# Altium schematic sheet SAMD51_DevBoard.SchDoc: SAMD51 Development Board
size A3; CompanyName: ALP Electronics; DrawnBy: Caner ALP; Engineer: Caner ALP; Organization: ALP Electronics; Address1: Vasteras; Address2: SWEDEN; DocumentNumber: 1; Revision: 0.1; SheetNumber: 1; SheetTotal: 1
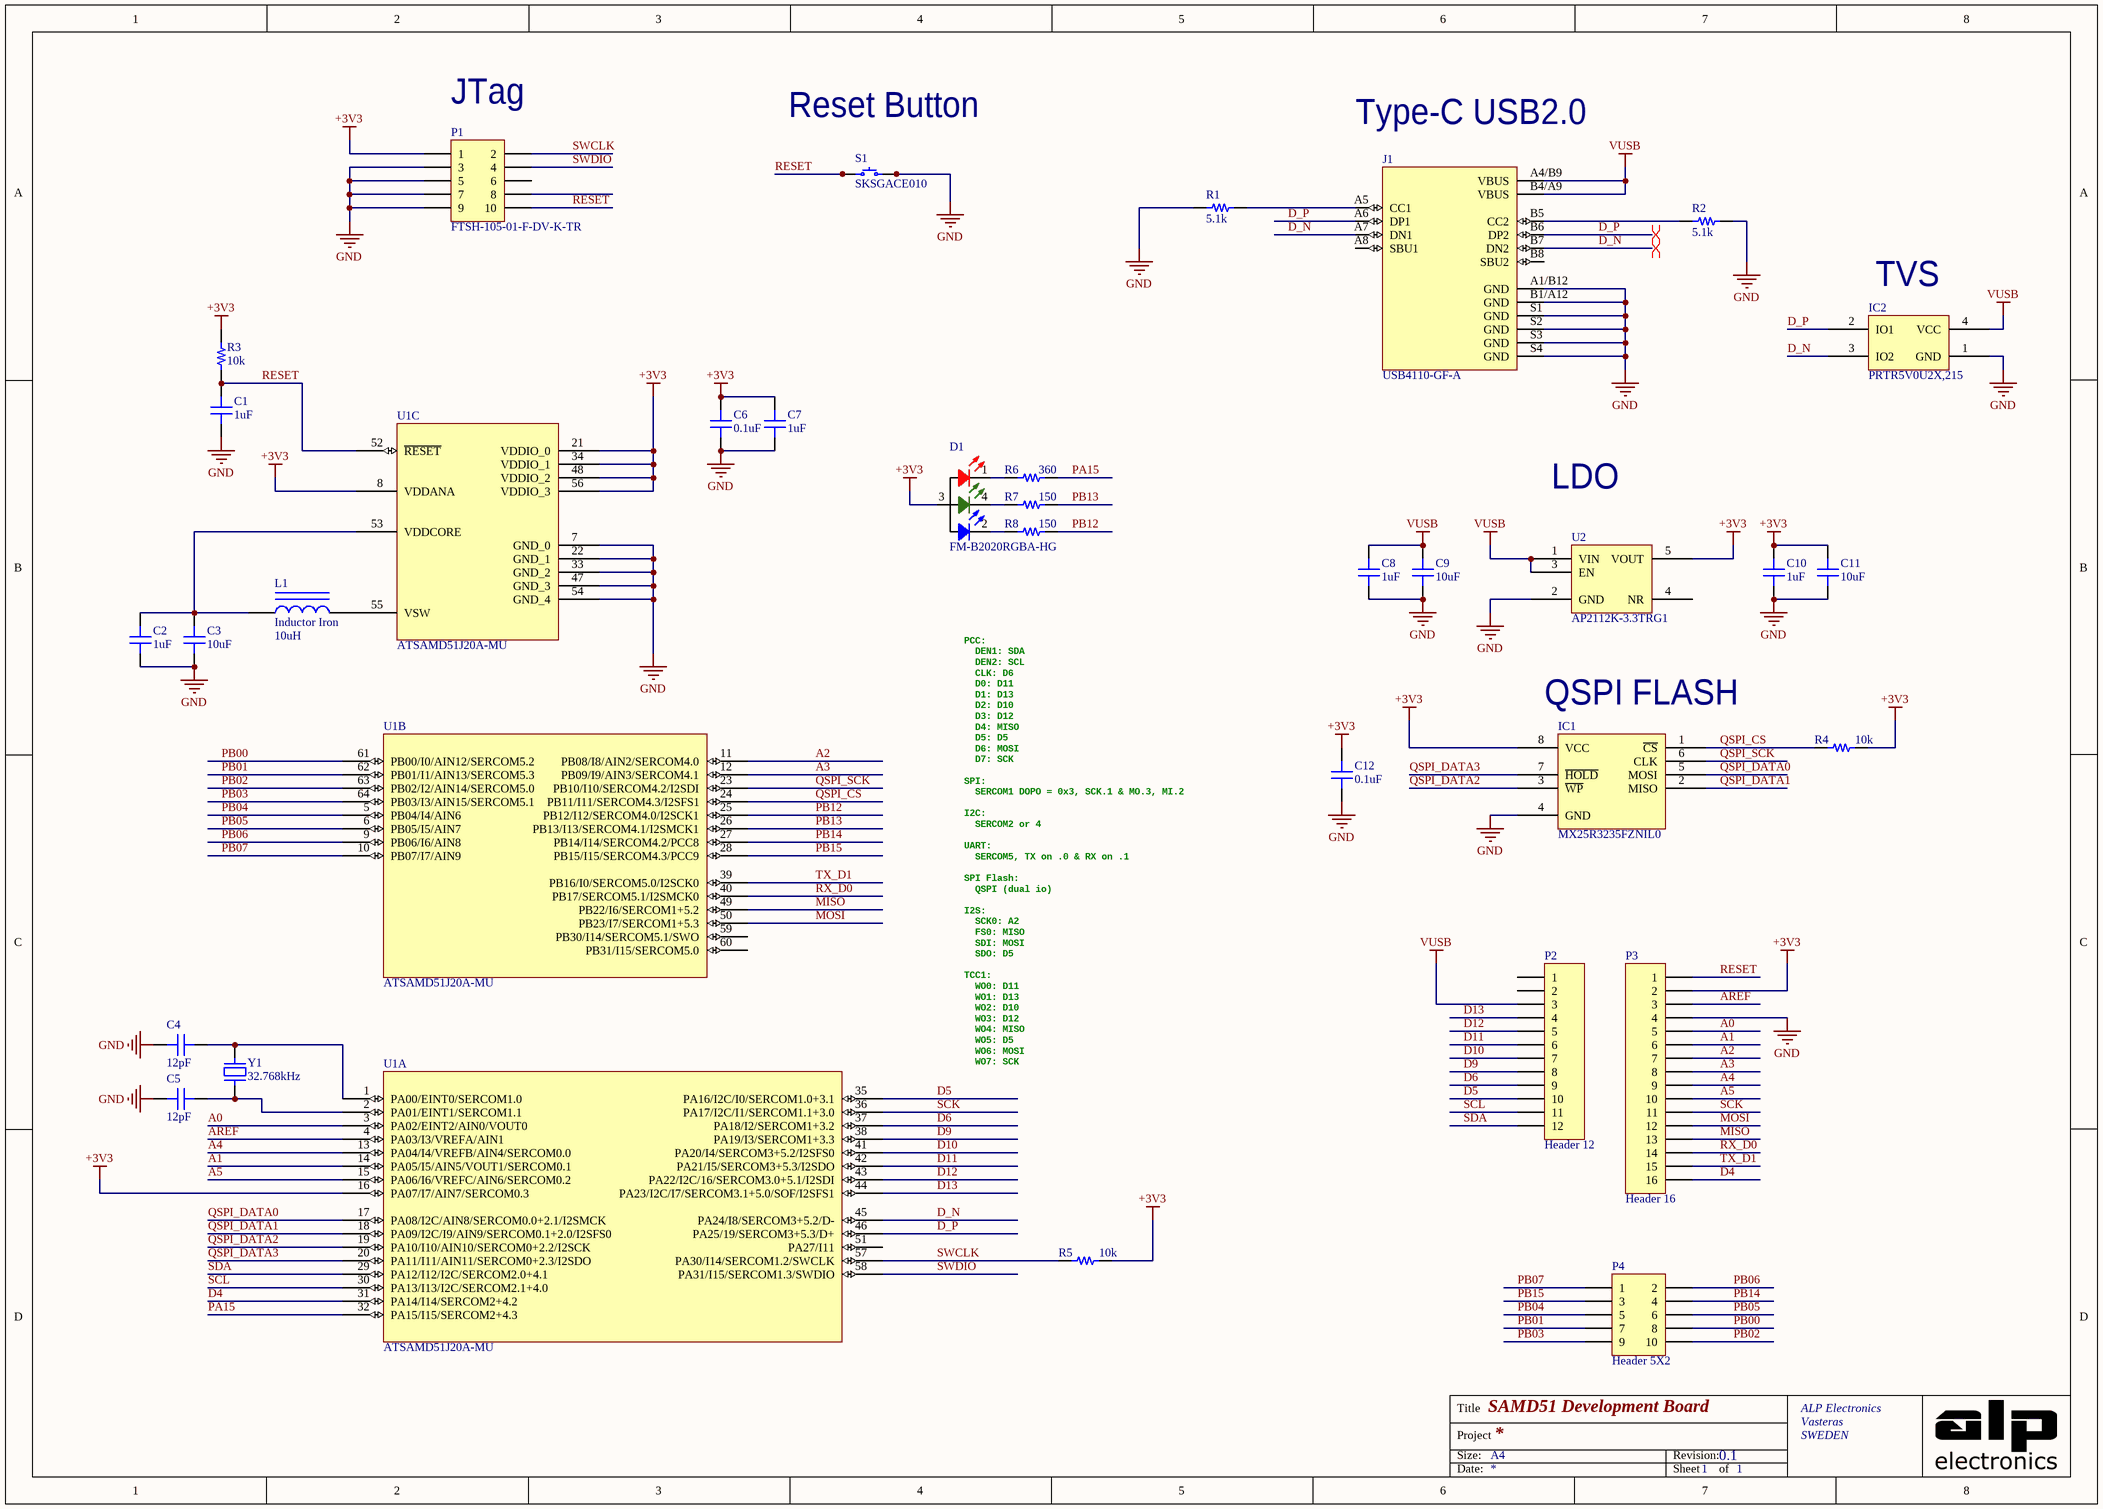
[diagram p0: SAMD51_DevBoard.SchDoc]

## Parts
C1  1uF  [CAP 0603/1608]
C2  1uF  [CAP 0603/1608]
C3  10uF  [CAP 0603/1608]
C4  12pF  [CAP 0603/1608]
C5  12pF  [CAP 0603/1608]
C6  0.1uF  [CAP 0603/1608]
C7  1uF  [CAP 0603/1608]
C8  1uF  [CAP 0603/1608]
C9  10uF  [CAP 0603/1608]
C10  1uF  [CAP 0603/1608]
C11  10uF  [CAP 0603/1608]
C12  0.1uF  [CAP 0603/1608]
D1  FM-B2020RGBA-HG  [FM-B2020RGBA-HG]
IC1  MX25R3235FZNIL0  [SPANSION WSON-8 6x5MM]
IC2  PRTR5V0U2X,215  [SOT143B]
J1  USB4110-GF-A  [USB4110-GF-A]
L1  Inductor Iron  value 10uH  [IND_Würth_74404020100]
P1  FTSH-105-01-F-DV-K-TR  [FTSH-105-01-F-DV-K-TR]
P2  Header 12  [HDR1X12]
P3  Header 16  [HDR1X16]
P4  Header 5X2  [HDR2X5]
R1  5.1k  [RES 0603/1608]
R2  5.1k  [RES 0603/1608]
R3  10k  [RES 0603/1608]
R4  10k  [RES 0603/1608]
R5  10k  [RES 0603/1608]
R6  360  [RES 0603/1608]
R7  150  [RES 0603/1608]
R8  150  [RES 0603/1608]
S1  SKSGACE010  [SKSGACE010]
U1  ATSAMD51J20A-MU  [SI LABS QFN-64_S]  (parts A,B,C of 3)
U2  AP2112K-3.3TRG1  [TI SOT-23-5 DBV]
Y1  32.768kHz  [ABRACON ABS07]

## Nets
+3V3: C6.2 C7.2 C10.2 C11.2 C12.2 D1.3 IC1.8(VCC) P1.1 P3.2 R3.2 R4.2 R5.2 U1.8(VDDANA) U1.16(PA07/I7/AIN7/SERCOM0.3) U1.21(VDDIO_0) U1.34(VDDIO_1) U1.48(VDDIO_2) U1.56(VDDIO_3) U2.5(VOUT)
GND: C1.1 C2.1 C3.1 C4.1 C5.1 C6.1 C7.1 C8.1 C9.1 C10.1 C11.1 C12.1 IC1.4(GND) IC2.1(GND) J1.A1/B12(GND) J1.B1/A12(GND) J1.S1(GND) J1.S2(GND) J1.S3(GND) J1.S4(GND) P1.3 P1.5 P1.7 P1.9 P3.4 R1.1 R2.2 S1.3 S1.4 U1.7(GND_0) U1.22(GND_1) U1.33(GND_2) U1.47(GND_3) U1.54(GND_4) U2.2(GND)
VUSB: C8.2 C9.2 IC2.4(VCC) J1.A4/B9(VBUS) J1.B4/A9(VBUS) P2.3 U2.1(VIN) U2.3(EN)
A0: P3.5 U1.3(PA02/EINT2/AIN0/VOUT0)
A1: P3.6 U1.14(PA05/I5/AIN5/VOUT1/SERCOM0.1)
A2: P3.7 U1.11(PB08/I8/AIN2/SERCOM4.0)
A3: P3.8 U1.12(PB09/I9/AIN3/SERCOM4.1)
A4: P3.9 U1.13(PA04/I4/VREFB/AIN4/SERCOM0.0)
A5: P3.10 U1.15(PA06/I6/VREFC/AIN6/SERCOM0.2)
AREF: P3.3 U1.4(PA03/I3/VREFA/AIN1)
D4: P3.16 U1.31(PA14/I14/SERCOM2+4.2)
D5: P2.10 U1.35(PA16/I2C/I0/SERCOM1.0+3.1)
D6: P2.9 U1.37(PA18/I2/SERCOM1+3.2)
D9: P2.8 U1.38(PA19/I3/SERCOM1+3.3)
D10: P2.7 U1.41(PA20/I4/SERCOM3+5.2/I2SFS0)
D11: P2.6 U1.42(PA21/I5/SERCOM3+5.3/I2SDO)
D12: P2.5 U1.43(PA22/I2C/16/SERCOM3.0+5.1/I2SDI)
D13: P2.4 U1.44(PA23/I2C/I7/SERCOM3.1+5.0/SOF/I2SFS1)
D_N: IC2.3(IO2) J1.A7(DN1) J1.B7(DN2) U1.45(PA24/I8/SERCOM3+5.2/D-)
D_P: IC2.2(IO1) J1.A6(DP1) J1.B6(DP2) U1.46(PA25/19/SERCOM3+5.3/D+)
MISO: P3.13 U1.49(PB22/I6/SERCOM1+5.2)
MOSI: P3.12 U1.50(PB23/I7/SERCOM1+5.3)
PA15: R6.2 U1.32(PA15/I15/SERCOM2+4.3)
PB00: P4.8 U1.61(PB00/I0/AIN12/SERCOM5.2)
PB01: P4.7 U1.62(PB01/I1/AIN13/SERCOM5.3)
PB02: P4.10 U1.63(PB02/I2/AIN14/SERCOM5.0)
PB03: P4.9 U1.64(PB03/I3/AIN15/SERCOM5.1)
PB04: P4.5 U1.5(PB04/I4/AIN6)
PB05: P4.6 U1.6(PB05/I5/AIN7)
PB06: P4.2 U1.9(PB06/I6/AIN8)
PB07: P4.1 U1.10(PB07/I7/AIN9)
PB12: R8.2 U1.25(PB12/I12/SERCOM4.0/I2SCK1)
PB13: R7.2 U1.26(PB13/I13/SERCOM4.1/I2SMCK1)
PB14: P4.4 U1.27(PB14/I14/SERCOM4.2/PCC8)
PB15: P4.3 U1.28(PB15/I15/SERCOM4.3/PCC9)
QSPI_CS: IC1.1(~{CS}) R4.1 U1.24(PB11/I11/SERCOM4.3/I2SFS1)
QSPI_DATA0: IC1.5(MOSI) U1.17(PA08/I2C/AIN8/SERCOM0.0+2.1/I2SMCK)
QSPI_DATA1: IC1.2(MISO) U1.18(PA09/I2C/I9/AIN9/SERCOM0.1+2.0/I2SFS0)
QSPI_DATA2: IC1.3(~{WP}) U1.19(PA10/I10/AIN10/SERCOM0+2.2/I2SCK)
QSPI_DATA3: IC1.7(~{HOLD}) U1.20(PA11/I11/AIN11/SERCOM0+2.3/I2SDO)
QSPI_SCK: IC1.6(CLK) U1.23(PB10/I10/SERCOM4.2/I2SDI)
RESET: C1.2 P1.10 P3.1 R3.1 S1.1 S1.2 U1.52(~{RESET})
RX_D0: P3.14 U1.40(PB17/SERCOM5.1/I2SMCK0)
SCK: P3.11 U1.36(PA17/I2C/I1/SERCOM1.1+3.0)
SCL: P2.11 U1.30(PA13/I13/I2C/SERCOM2.1+4.0)
SDA: P2.12 U1.29(PA12/I12/I2C/SERCOM2.0+4.1)
SWCLK: P1.2 R5.1 U1.57(PA30/I14/SERCOM1.2/SWCLK)
SWDIO: P1.4 U1.58(PA31/I15/SERCOM1.3/SWDIO)
TX_D1: P3.15 U1.39(PB16/I0/SERCOM5.0/I2SCK0)
NetC2_2: C2.2 C3.2 L1.1 U1.53(VDDCORE)
NetC4_2: C4.2 U1.1(PA00/EINT0/SERCOM1.0) Y1.2
NetC5_2: C5.2 U1.2(PA01/EINT1/SERCOM1.1) Y1.1
NetD1_1: D1.1 R6.1
NetD1_2: D1.2 R8.1
NetD1_4: D1.4 R7.1
NetJ1_A5: J1.A5(CC1) R1.2
NetJ1_B5: J1.B5(CC2) R2.1
NetL1_2: L1.2 U1.55(VSW)

Not connected (* = marked no-connect by the designer): J1 A8(SBU1) B8(SBU2); P1 6 8; P2 1 2; U1 51(PA27/I11) 59(PB30/I14/SERCOM5.1/SWO) 60(PB31/I15/SERCOM5.0); U2 4(NR)

## Layout directives
differential pair; differential pair class DIFF: D_P
differential pair: D_N

## Notes on the sheet
- (near P1) JTag
- (near S1) Reset Button
- (near J1) Type-C USB2.0
- (near IC2) TVS
- LDO
- (near IC1) QSPI FLASH
- PCC:
  DEN1: SDA
  DEN2: SCL
  CLK: D6
  D0: D11
  D1: D13
  D2: D10
  D3: D12
  D4: MISO
  D5: D5
  D6: MOSI
  D7: SCK
  SPI:
  SERCOM1 DOPO = 0x3, SCK.1 & MO.3, MI.2
  I2C:
  SERCOM2 or 4
  UART:
  SERCOM5, TX on .0 & RX on .1
  SPI Flash:
  QSPI (dual io)
  I2S:
  SCK0: A2
  FS0: MISO
  SDI: MOSI
  SDO: D5
  TCC1:
  WO0: D11
  WO1: D13
  WO2: D10
  WO3: D12
  WO4: MISO
  WO5: D5
  WO6: MOSI
  WO7: SCK
- Title
- Size:
- Project
- A4
- Revision:
- Date:
- Sheet
- of

## Library data of the parts
C1 C2 C7 C8 C10 = C0603C105K4PACTU: CAP CER 1UF 16V X5R 0603; Manufacturer: Kemet; TemperatureRange: -55C ~ 85C; Tolerance: 10%; Value: 1uF; Part Number: C0603C105K4PACTU; PartId: 12982; Supplier 1: Digi-Key; Supplier Part Number 1: 399-5090-2-ND; ComponentLink1Description: Datasheet; ComponentLink1URL: http://www.kemet.com/docfinder?Partnumber=C0603C105K4PACTU; ComponentLink2Description: Digi-Key Listing; ComponentLink2URL: https://www.digikey.com/product-detail/en/kemet/C0603C105K4PACTU/399-5090-2-ND/1465595; TemperatureCoefficient: X5R; Voltage: 16V; Price: 0.0156; Device Package: 0603 (1608 Metric)
C3 C9 C11 = GRM188R60J106ME47D: CAP CER 10UF 6.3V X5R 0603; Manufacturer: Murata Electronics North America; TemperatureRange: -55C ~ 85C; Tolerance: 20%; Value: 10uF; Part Number: GRM188R60J106ME47D; PartId: 12950; Supplier 1: Digi-Key; Supplier Part Number 1: 490-3896-2-ND; ComponentLink1Description: Datasheet; ComponentLink1URL: http://www.murata.com/~/media/webrenewal/support/library/catalog/products/capacitor/mlcc/c02e.pdf; ComponentLink2Description: Digi-Key Listing; ComponentLink2URL: https://www.digikey.com/product-detail/en/murata-electronics-north-america/GRM188R60J106ME47D/490-3896-2-ND/965910; TemperatureCoefficient: X5R; Voltage: 6.3V; Price: 0.031; Device Package: 0603 (1608 Metric)
C4 C5 = C1608C0G1H120J080AA: CAP CER 12PF 50V C0G 0603; Manufacturer: TDK Corporation; TemperatureRange: -55C ~ 125C; TemperatureCoefficient: C0G, NP0; Tolerance: 5%; Value: 12pF; Part Number: C1608C0G1H120J080AA; PartId: 4060; Supplier 1: Digi-Key; Supplier Part Number 1: 445-1270-1-ND; ComponentLink1Description: Datasheet; ComponentLink1URL: https://product.tdk.com/info/en/catalog/datasheets/mlcc_commercial_general_en.pdf; ComponentLink2Description: Digi-Key listing; ComponentLink2URL: http://digikey.com/product-detail/en/C1608C0G1H120J080AA/445-1270-1-ND/567672; Voltage: 50V; Price: 0.14; Type: -; Device Package: 0603 (1608 Metric)
C6 C12 = CL10B104JO8NNNC: CAP CER 0.1UF 16V X7R 0603; Manufacturer: Samsung Electro-Mechanics America, Inc.; TemperatureRange: -55C ~ 125C; Tolerance: 5%; Value: 0.1uF; Part Number: CL10B104JO8NNNC; PartId: 5417; Supplier 1: Digi-Key; Supplier Part Number 1: 1276-1061-2-ND; ComponentLink1Description: Datasheet; ComponentLink1URL: http://www.samsungsem.com/kr/support/product-search/mlcc/CL10B104JO8NNNC.jsp; ComponentLink2Description: Digi-Key listing; ComponentLink2URL: http://digikey.com/product-detail/en/CL10B104JO8NNNC/1276-1061-2-ND/3886719; TemperatureCoefficient: X7R; Voltage: 16V; Price: 0.0132; Type: -; Device Package: 0603 (1608 Metric)
D1 = FM-B2020RGBA-HG: RGB 615~630nmRed,515~535nmGreen,465~480nmBlue 2020; Manufacturer: Foshan NationStar Optoelectronics; Value: Green; Type: Surface Mount; Part Number: FM-B2020RGBA-HG; PartId: 10872; Supplier 1: LCSC; Supplier Part Number 1: C108793; ComponentLink1Description: Datasheet; ComponentLink1URL: https://datasheet.lcsc.com/szlcsc/1810231210_Foshan-NationStar-Optoelectronics-FM-B2020RGBA-HG_C108793.pdf; ComponentLink2Description: LCSC Listing; ComponentLink2URL: https://lcsc.com/product-detail/Light-Emitting-Diodes-LED_FM-B2020RGBA-HG_C108793.html; Device Package: 2020; Colour: RGB
IC1 = S25FL116K0XNFI011: IC FLASH MEM 16MB SPI CMOS 8WSON; Manufacturer: Spansion; Memory Type: FLASH - NOR; Memory Size: 16M (2M x 8); Speed: 108MHz; Interface: SPI Serial; Voltage - Supply: 2.7 V ~ 3.6 V; Part Number: S25FL116K0XNFI011; PartId: 8258; Supplier 1: Digi-Key; Supplier Part Number 1: 1274-1131-ND; ComponentLink1Description: Datasheet; ComponentLink1URL: http://www.spansion.com/Support/Datasheets/S25FL1-K_00.pdf; ComponentLink2Description: Digi-Key Listing; ComponentLink2URL: http://www.digikey.com/product-detail/en/S25FL116K0XNFI011/1274-1131-ND/4517162; Price: 0,49; Type: FLASH - NOR; Device Package: 8-WDFN Exposed Pad; Operating Temperature: -40C ~ 85C
IC2 = PRTR5V0U2X,215: TVS DIODE 5.5VWM SOT143B; Manufacturer: NXP Semiconductors; Voltage (Breakdown): 6V; Voltage (Reverse Standoff): 5.5V (Max); Part Number: PRTR5V0U2X,215; PartId: 9755; Supplier 1: Digi-Key; Supplier Part Number 1: 568-4140-2-ND; ComponentLink1Description: Datasheet; ComponentLink1URL: http://www.nxp.com/documents/data_sheet/PRTR5V0U2X.pdf; ComponentLink2Description: Digi-Key Listing; ComponentLink2URL: http://www.digikey.com/product-detail/en/nxp-semiconductors/PRTR5V0U2X,215/568-4140-2-ND/1163690; Operating Temperature: -40C ~ 85C (TA); Price: 0.1794; Type: Steering (Rail to Rail); Device Package: TO-253-4, TO-253AA; Power - Peak Pulse: -; Current - Peak Pulse: -; Voltage (Clamping): -
J1 = USB4110-GF-A: CONN USB 2.0 TYPE-C R/A SMT; Manufacturer: GCT; Part Number: USB4110-GF-A; PartId: 9701; Supplier 1: Digi-Key; Supplier Part Number 1: 2073-USB4110-GF-A-1-ND; ComponentLink1Description: Datasheet; ComponentLink1URL: https://gct.co/files/drawings/usb4110.pdf
L1 = Inductor Iron: Magnetic-Core Inductor; Published: 24-Mar-1999; LatestRevisionDate: 17-Jul-2002; LatestRevisionNote: Re-released for DXP Platform.; PackageReference: AXIAL-0.9; Publisher: Altium Limited; PackageDescription: Axial Device, Thru-Hole; 2 Leads; 0.9 in Pin Spacing
P1 P4 = Header 5X2: Header, 5-Pin, Dual row; LatestRevisionDate: 17-Jul-2002; LatestRevisionNote: Re-released for DXP Platform.; Publisher: Altium Limited
P2 = Header 12: Header, 12-Pin; LatestRevisionDate: 17-Jul-2002; LatestRevisionNote: Re-released for DXP Platform.; Publisher: Altium Limited
P3 = Header 16: Header, 16-Pin; LatestRevisionDate: 17-Jul-2002; LatestRevisionNote: Re-released for DXP Platform.; Publisher: Altium Limited
R1 R2 = ERJ-3GEYJ512V: RES SMD 5.1K OHM 5% 1/10W 0603; Manufacturer: Panasonic Electronic Components; TemperatureRange: -55C ~ 155C; TemperatureCoefficient: 200ppm/C; PowerRating: 0.1W, 1/10W; Value: 5.1k; Part Number: ERJ-3GEYJ512V; PartId: 11206; Supplier 1: Digi-Key; Supplier Part Number 1: P5.1KGTR-ND; ComponentLink1Description: Datasheet; ComponentLink1URL: http://industrial.panasonic.com/www-cgi/jvcr13pz.cgi?E+PZ+3+AOA0001+ERJ3GEYJ512V+7+WW; ComponentLink2Description: Digi-Key Listing; ComponentLink2URL: https://www.digikey.com/product-detail/en/panasonic-electronic-components/ERJ-3GEYJ512V/P5.1KGTR-ND/135918; Tolerance: 5%; Price: 0.002; Device Package: 0603 (1608 Metric)
R3-R5 = ERJ-3GEYJ103V: RES SMD 10K OHM 5% 1/10W 0603; Manufacturer: Panasonic Electronic Components; TemperatureRange: -55C ~ 155C; TemperatureCoefficient: 200ppm/C; PowerRating: 0.1W, 1/10W; Value: 10k; Part Number: ERJ-3GEYJ103V; PartId: 11175; Supplier 1: Digi-Key; Supplier Part Number 1: P10KGTR-ND; ComponentLink1Description: Datasheet; ComponentLink1URL: http://industrial.panasonic.com/www-cgi/jvcr13pz.cgi?E+PZ+3+AOA0001+ERJ3GEYJ103V+7+WW; ComponentLink2Description: Digi-Key Listing; ComponentLink2URL: https://www.digikey.com/product-detail/en/panasonic-electronic-components/ERJ-3GEYJ103V/P10KGTR-ND/135662; Tolerance: 5%; Price: 0.002; Device Package: 0603 (1608 Metric)
R6 = ERJ-3GEYJ361V: RES SMD 360 OHM 5% 1/10W 0603; Manufacturer: Panasonic Electronic Components; TemperatureRange: -55C ~ 155C; TemperatureCoefficient: 200ppm/C; PowerRating: 0.1W, 1/10W; Value: 360; Part Number: ERJ-3GEYJ361V; PartId: 11239; Supplier 1: Digi-Key; Supplier Part Number 1: P360GTR-ND; ComponentLink1Description: Datasheet; ComponentLink1URL: http://industrial.panasonic.com/www-cgi/jvcr13pz.cgi?E+PZ+3+AOA0001+ERJ3GEYJ361V+7+WW; ComponentLink2Description: Digi-Key Listing; ComponentLink2URL: https://www.digikey.com/product-detail/en/panasonic-electronic-components/ERJ-3GEYJ361V/P360GTR-ND/135761; Tolerance: 5%; Price: 0.002; Device Package: 0603 (1608 Metric)
R7 R8 = ERJ-3GEYJ151V: RES SMD 150 OHM 5% 1/10W 0603; Manufacturer: Panasonic Electronic Components; TemperatureRange: -55C ~ 155C; TemperatureCoefficient: 200ppm/C; PowerRating: 0.1W, 1/10W; Value: 150; Part Number: ERJ-3GEYJ151V; PartId: 11200; Supplier 1: Digi-Key; Supplier Part Number 1: P150GTR-ND; ComponentLink1Description: Datasheet; ComponentLink1URL: http://industrial.panasonic.com/www-cgi/jvcr13pz.cgi?E+PZ+3+AOA0001+ERJ3GEYJ151V+7+WW; ComponentLink2Description: Digi-Key Listing; ComponentLink2URL: https://www.digikey.com/product-detail/en/panasonic-electronic-components/ERJ-3GEYJ151V/P150GTR-ND/135689; Tolerance: 5%; Price: 0.002; Device Package: 0603 (1608 Metric)
S1 = SKSGACE010: SWITCH TACTILE SPST-NO 0.05A 16V; Manufacturer: ALPS; Part Number: SKSGACE010; PartId: 16471; Supplier 1: Mouser; Supplier Part Number 1: 688-SKSGACE010; ComponentLink1Description: Datasheet; ComponentLink1URL: https://www.mouser.se/datasheet/2/15/SKSG-1370727.pdf; ComponentLink2Description: Mouser Listing; ComponentLink2URL: https://www.mouser.se/ProductDetail/ALPS/SKSGACE010?qs=Ptl%2FSkKmb3BEFq%252BG855%2Fog==
U1 = ATSAMD51J20A-MU: IC MCU 32BIT 1MB FLASH 64VQFN; Manufacturer: Microchip Technology; Core Processor: ARM Cortex-M4; Part Number: ATSAMD51J20A-MU; PartId: 10980; Supplier 1: Digi-Key; Supplier Part Number 1: ATSAMD51J20A-MU-ND; ComponentLink1Description: Datasheet; ComponentLink1URL: http://ww1.microchip.com/downloads/en/DeviceDoc/60001507E.pdf; ComponentLink2Description: Digi-Key Listing; ComponentLink2URL: https://www.digikey.com/product-detail/en/microchip-technology/ATSAMD51J20A-MU/ATSAMD51J20A-MU-ND/7390352; Device Package: 64-VFQFN Exposed Pad
U2 = TPS73633DBVT: IC REG LINEAR 3.3V 400MA SOT23-5; Manufacturer: Texas Instruments; Topology: Positive Fixed; Part Number: TPS73633DBVT; PartId: 7968; Supplier 1: Digi-Key; Supplier Part Number 1: 296-15819-1-ND; Device Package: SOT-23-5; Voltage - Output: 3.3V
Y1 = ABS07-32.768KHZ-T: CRYSTAL 32.7680KHZ 12.5PF SMD; Manufacturer: Abracon LLC; Frequency Tolerance: 20ppm; ESR: 70 kOhm; Operating Mode: Fundamental; Part Number: ABS07-32.768KHZ-T; PartId: 8487; Supplier 1: Digi-Key; Supplier Part Number 1: 535-9542-2-ND; ComponentLink1Description: Datasheet; ComponentLink1URL: http://www.abracon.com/Resonators/ABS07.pdf; ComponentLink2Description: Digi-Key Listing; ComponentLink2URL: http://www.digikey.com/product-detail/en/ABS07-32.768KHZ-T/535-9542-2-ND/1236858; Price: 0,3; Type: kHz Crystal (Tuning Fork); Device Package: 2-SMD; Frequency: 32.768kHz; Frequency Stability: -; Load Capacitance: 12.5pF